# Altium project USB_Oscilloscope.PrjPcb (part 2 of 2)

## Sheet Trigger.SchDoc
size A; SheetNumber: 5; SheetTotal: 6
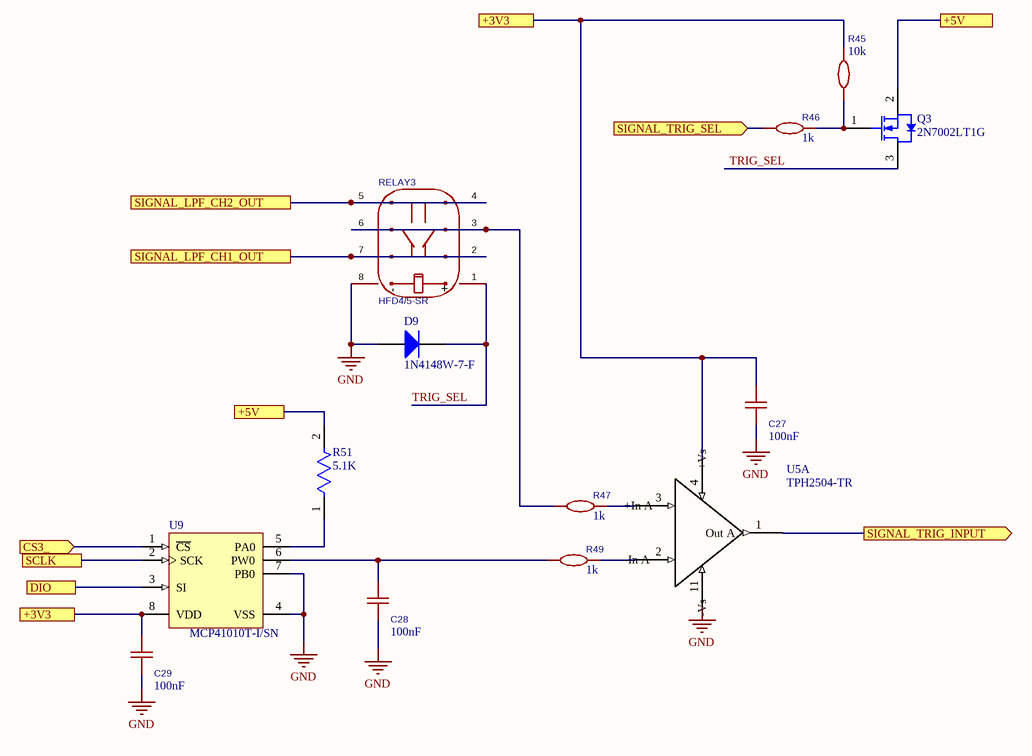
[diagram p4: Trigger.SchDoc]

### Parts
C27  value 100nF  [C0805]  (hidden comment: 0805CG6R0C500NT_C67560)
C28  value 100nF  [C0805]  (hidden comment: 0805CG6R0C500NT_C67560)
C29  value 100nF  [C0805]  (hidden comment: 0805CG6R0C500NT_C67560)
D9  1N4148W-7-F  [DIOD-SOD123-2_V]
Q3  2N7002LT1G  [ONSC-SOT-23-3-318-08_V]
R45  value 10k  [R0805]  (hidden comment: 0805W8F0000T5E_C17477)
R46  value 1k  [R0805]  (hidden comment: 0805W8F0000T5E_C17477)
R47  value 1k  [R0805]  (hidden comment: 0805W8F0000T5E_C17477)
R49  value 1k  [R0805]  (hidden comment: 0805W8F0000T5E_C17477)
R51  5.1K  [FP-RT0805-MFG]
RELAY3  HFD4/5-SR  [RELAY-SMD_HFD4-5-SR]
U5  TPH2504-TR  [TSOP65P640X120-14N]  (part A of 4)
U9  MCP41010T-I/SN  [SOIC-SN8_M]

### Ports
+3V3 (see H723ZG_Interface[1A], PGA[2A], PGA[2B], PGA[4A], PGA[4C], REF_VOLTAGE_RELAY_DRIVER[1A], REF_VOLTAGE_RELAY_DRIVER[2B], REF_VOLTAGE_RELAY_DRIVER[2C], REF_VOLTAGE_RELAY_DRIVER[4A], Trigger[1C]), +3V3 (see H723ZG_Interface[1A], PGA[2A], PGA[2B], PGA[4A], PGA[4C], REF_VOLTAGE_RELAY_DRIVER[1A], REF_VOLTAGE_RELAY_DRIVER[2B], REF_VOLTAGE_RELAY_DRIVER[2C], REF_VOLTAGE_RELAY_DRIVER[4A], Trigger[3A]), +5V (see H723ZG_Interface[1A], PGA[3A], PGA[3C], REF_VOLTAGE_RELAY_DRIVER[2C], REF_VOLTAGE_RELAY_DRIVER[3B], Trigger[2B]), +5V (see H723ZG_Interface[1A], PGA[3A], PGA[3C], REF_VOLTAGE_RELAY_DRIVER[2C], REF_VOLTAGE_RELAY_DRIVER[3B], Trigger[4A]), CS3_ (in, see H723ZG_Interface[3A]), DIO (see H723ZG_Interface[3A], PGA[4B], PGA[4C]), SCLK (see H723ZG_Interface[3A], PGA[4B], PGA[4C]), SIGNAL_LPF_CH1_OUT (see H723ZG_Interface[1C], LPF[4A]), SIGNAL_LPF_CH2_OUT (see H723ZG_Interface[1C], LPF[4C]), SIGNAL_TRIG_INPUT (out, see H723ZG_Interface[4C]), SIGNAL_TRIG_SEL (in, see H723ZG_Interface[4B])

### Nets
GND: C27.2 C28.2 C29.2 D9.1(A) RELAY3.8 U5.11(-Vs) U9.4(VSS) U9.7(PB0)
+3V3: C27.1 C29.1 R45.2 U5.4(+Vs) U9.8(VDD) ; port +3V3
+5V: Q3.2(S) R51.2 ; port +5V
CS3_: U9.1(~{CS}) ; port CS3_
DIO: U9.3(SI) ; port DIO
SCLK: U9.2(SCK) ; port SCLK
SIGNAL_LPF_CH1_OUT: RELAY3.2 RELAY3.7 ; port SIGNAL_LPF_CH1_OUT
SIGNAL_LPF_CH2_OUT: RELAY3.4 RELAY3.5 ; port SIGNAL_LPF_CH2_OUT
SIGNAL_TRIG_INPUT: U5.1(Out_A) ; port SIGNAL_TRIG_INPUT
SIGNAL_TRIG_SEL: R46.1 ; port SIGNAL_TRIG_SEL
TRIG_SEL: D9.2(K) Q3.3(D) RELAY3.1
NetC28_1: C28.1 R49.1 U9.6(PW0)
NetQ3_1: Q3.1(G) R45.1 R46.2
NetR47_1: R47.1 RELAY3.3 RELAY3.6
NetR47_2: R47.2 U5.3(+In_A)
NetR49_2: R49.2 U5.2(-In_A)
NetR51_1: R51.1 U9.5(PA0)

### Notes on the sheet
- (in symbol CMP-006-000000-2) -; +

### Library data of the parts
C27-C29 = CMP-015-000003-2: Capacitance:100nF Tolerance:±5% Tolerance:±5% Voltage Rating:50V Temperature Coefficient:X7R; Manufacturer: YAGEO(国巨); AddInBom: yes; Device: CC0805JRX7R9BB104; ModelId: 8c88e81f49c6409b980720ec8953afb6聨0819f05c4eef4c71ace90d822a990e87; ModelName: C0805_L2.0-W1.3-H1.3; ModelTransform: 78.74,51.181,0,0,0,0,0,0.0005,0; Temperature Coefficient: X7R; Tolerance: 5%; Voltage Rating: 50V; ConvertToPcb: yes; Datasheet: https://item.szlcsc.com/datasheet/CC0805JRX7R9BB104/112720.html; Design Item ID: CC0805JRX7R9BB104; FootprintName: C0805; JLCPCB Part Class: Extended Part; LCSC Part Name: 100nF ±5% 50V; Source: P1.SCHLIB; Supplier Footprint: 0805; Symbol: CC0805JRX7R9BB104; Manufacturer Part Number: CC0805JRX7R9BB104; Supplier Part Number: C111492
D9 = CMP-2000-04932-2: Fast Switching Diode, 100 V, 0.15 A, -65 to 150 degC, 2-Pin?SOD123, RoHS, Tape and Reel; Manufacturer: Diodes Inc; Recovery Time: 4ns; Unit Weight: 0.000353oz; Max Surge Current: 2A; Peak Reverse Voltage: 100V; Ir - Reverse Current: 1uA; Vf - Forward Voltage: 1.25V; Configuration: Single; If - Forward Current: 0.15A; Product Category: Diodes-GeneralPurpose,Power,Switching; Operating Temperature Range: -65Cto+150C; Packaging: Reel; Manufacturer URL: http://www.diodes.com/; Maximum Operating Temperature: +150C; Height: 1.25mm; Minimum Operating Temperature: -65C; Product: SwitchingDiodes; Package URL: http://www.diodes.com/datasheets/ds18004.pdf; Type: SwitchingDiode; Package Reference: SOD123-2; Width: 1.7mm; Datasheet URL: http://www.farnell.com/datasheets/1915529.pdf; Datasheet Version: Rev. 24-2, 10/2013; Series: 1N4148; Factory Pack Quantity: 3000; Length: 2.85mm; RoHS: True; Mounting Style: SMD/SMT; Package / Case: SOD-123
Q3 = CMP-1058-00781-1: Small Signal MOSFET, 60 V, 115 mA, N-Channel, 3-Pin SOT-23, Pb-Free, Tape and Reel; Manufacturer: On Semiconductor; Channel Polarity: N Channel; V(BR)DSS Min (V): 60; ID Max (A): 0.115; VGS Max (V): 20; Configuration: Single; VGS(th) Max (V): 2.5; ComponentLink1URL: http://www.onsemi.com/; ComponentLink3Description: Package Specification; ComponentLink3URL: http://www.onsemi.cn/pub_link/Collateral/318-08.PDF; PackageReference: SOT-23-3-318-08; RoHS: Pb-Free; ComponentLink2URL: http://www.onsemi.com/pub_link/Collateral/2N7002L-D.PDF; ComponentLink1Description: Manufacturer URL; Package Type: SOT-23-3; Packing: Tape and Reel; PartNumber: 2N7002LT1G; DatasheetVersion: Rev. 7; Mounting Technology: Surface Mount; ComponentLink2Description: Datasheet; PackageDescription: 3-Pin Small Outline Transistor, Body 2.92 x 1.3 mm, Pitch 0.95 mm; PackageVersion: Rev. AP, 11/2009
R45 = CMP-016-000002-1: Type:Thick Film Resistor Resistance:10kΩ Tolerance:±1% Tolerance:±1% Power(Watts):125mW Voltage-Supply(Max):150V Temperature Coefficient:±100ppm/℃ Temperature Coefficient:±100ppm/℃ Operating Temperature:-55℃~+155℃ Operating Temperature:-55℃~+155℃; Manufacturer: UNI-ROYAL(厚声); AddInBom: yes; Device: 0805W8F1002T5E; ModelId: b83c7c5430874b8eb2319a65d9433429聨0819f05c4eef4c71ace90d822a990e87; ModelName: R0805_L2.0-W1.3-H0.6; ModelTransform: 78.74,51.181,0,0,0,0,0,-0.0005,0; Power(Watts): 125mW; Tolerance: 1%; Voltage-Supply(Max): 150V; ConvertToPcb: yes; Datasheet: https://item.szlcsc.com/datasheet/0805W8F1002T5E/18102.html; Design Item ID: 0805W8F1002T5E; FootprintName: R0805; JLCPCB Part Class: Basic Part; LCSC Part Name: 10kΩ ±1% 125mW 厚膜电阻; Operating Temperature: -55℃~+155℃; Source: P1.SCHLIB; Supplier Footprint: 0805; Symbol: 0805W8F1002T5E; Temperature Coefficient: ±100ppm/℃; Type: Thick Film Resistor; Manufacturer Part Number: 0805W8F1002T5E; Supplier Part Number: C17414
R46 R47 R49 = CMP-016-000001-1: Type:Thick Film Resistors Resistance:1kΩ Tolerance:±1% Tolerance:±1% Power(Watts): Overload Voltage (Max): Temperature Coefficient:±100ppm/℃ Temperature Coefficient:±100ppm/℃ Operating Temperature Range:-55℃~+155℃ Operating Temperature Range:-55℃~+155℃; Manufacturer: UNI-ROYAL(厚声); AddInBom: yes; Device: 0805W8F1001T5E; ModelId: b83c7c5430874b8eb2319a65d9433429聨0819f05c4eef4c71ace90d822a990e87; ModelName: R0805_L2.0-W1.3-H0.6; ModelTransform: 78.74,51.181,0,0,0,0,0,-0.0005,0; Tolerance: 1%; ConvertToPcb: yes; Datasheet: https://atta.szlcsc.com/upload/public/pdf/source/20200306/C422600_1E6D84923E4A46A82E41ADD87F860B5C.pdf; Design Item ID: 0805W8F1001T5E; FootprintName: R0805; JLCPCB Part Class: Basic Part; LCSC Part Name: 1kΩ ±1% 125mW 厚膜电阻; Operating Temperature Range: -55℃~+155℃; Source: P1.SCHLIB; Supplier Footprint: 0805; Symbol: 0805W8F1001T5E; Temperature Coefficient: ±100ppm/℃; Type: Thick Film Resistors; Manufacturer Part Number: 0805W8F1001T5E; Supplier Part Number: C17513
R51 = CMP-00006-1: 125mW Thin Film Resistor ±50ppm/℃ ±1% 5.1kΩ 0805 Chip Resistor - Surface Mount ROHS; Manufacturer Package Identifier: 0805 (2012 metric); Voltage Rating: 150V; Temperature Coefficient: 50ppm/°C; Depth: 1.25mm; Max Power Dissipation: 125mW; Lifecycle Status: Production; Min Operating Temperature: -55°C; Mounting Technology: Surface Mount; Value: 5.1kΩ; Case Code (Imperial): 0805; Max Operating Temperature: 155°C; Radiation Hardening: No; Power Rating: 125mW; Number of Terminals: 2; Voltage Rating (DC): 150V; Case/Package: 0805; Length: 2mm; RoHS: Compliant; Number of Terminations: 2; China RoHS: Non-Compliant; Working Voltage: 150V; Termination: SMD/SMT; Military Standard: Not; Composition: Thin Film; Height: 500µm; Tolerance: 1%; REACH SVHC: Yes; Contact Plating: Tin; Width: 1.25mm; Lead Free: Lead Free
RELAY3 = CMP-006-000000-2: Coil Voltage:5V Contact Form:2 Form C: 2C (DPDT-CO) Number of Pins:8 Contact Rating:1A@30VDC；300mA@125VAC Switching Voltage(Max):250V@AC；220V@DC Contact Material:AgNi + Gold plated Coil Rated Power:140mW Coil Resistance:178Ω Switching Current(Max):2A Oper; Manufacturer: HF(宏发); Release Time: 3ms; Coil Voltage: 5V; Coil Type: Polarized-Single Coil; AddInBom: yes; ModelName: RELAY-SMD_L10.0-W6.5-H5.7-LS7.5-P2.2; ModelTransform: 393.7,307.086,0,0,0,0,-0.005,0,0; ModelId: abc4320b17a04819849f22b1ebcd3fe7聨0819f05c4eef4c71ace90d822a990e87; Switching Current(Max): 2A; Coil Resistance: 178Ω; Coil Rated Power: 140mW; Contact Resistance: 100mΩ; Contact Rating: 1A@30VDC；300mA@125VAC; Symbol: HFD4/5-S; JLCPCB Part Class: Extended Part; Operating Temperature: -40℃~+85℃; ConvertToPcb: yes; FootprintName: RELAY-SMD_HFD4-5-SR; Supplier Footprint: SMD,10x6.5mm; Device: HFD4/5-SR; Switching Voltage(Max): 250V@AC；220V@DC; Contact Form: 2 Form C: 2C (DPDT-CO); Datasheet: https://item.szlcsc.com/datasheet/HFD4%252F5-SR/65466.html; Contact Material: AgNi + Gold plated; Design Item ID: HFD4/5-SR; Number of Pins: 8; LCSC Part Name: 超小型5V继电器 双刀双掷; Source: P1.SCHLIB; Operate Time: 3ms; Manufacturer Part Number: HFD4/5-SR; Supplier Part Number: C64399
U5 = CMP-00002-9: Operational Amplifier, 4 Func, 5000uV Offset-Max, CMOS, PDSO14; Max Supply Voltage: 7V; Number of Circuits: 4; Nominal Supply Voltage (DC): 3V; Input Offset Voltage (Vos): 5mV; Max Supply Current: 48mA; GAIN: 120Meg; Unity Gain Bandwidth Product: 120MHz; Common Mode Rejection Ratio: 45dB; Slew Rate: 160V/µs; Number of Terminals: 14; Terminal Pitch: 650µm; Max Operating Temperature: 125°C; Height - Seated (Max): 1.2mm; Length: 4.96mm; Min Operating Temperature: -40°C; RoHS: Compliant; Width: 4.4mm; Case/Package: TSSOP; Temperature Grade: Automotive
U9 = CMP-0188-00466-2: Single/Dual Digital Potentiometer with SPI Interface, 8-Pin SOIC 150mil, Industrial Temperature, Tape and Reel; ComponentLink2URL: http://ww1.microchip.com/downloads/en/DeviceDoc/11195c.pdf; PackageReference: SOIC-SN8; PackageDescription: 8-Lead Plastic Small Outline (SN) - Narrow, 3.90mm Body [SOIC]; ComponentLink3URL: http://www.microchip.com/stellent/groups/techpub_sg/documents/packagingspec/en012702.pdf; ComponentLink2Description: Datasheet; Code_JEDEC: MS-012; ComponentLink1URL: http://www.microchip.com/; PackageVersion: revBB, Aug-2009; DatasheetVersion: Jul-2003; ComponentLink1Description: Manufacturer URL; ComponentLink3Description: Package Specification; Code_IPC: SOIC127P600-8; RevisionNote: URLs added.

## Sheet H723ZG_Interface.SchDoc
size A; SheetNumber: 6; SheetTotal: 6
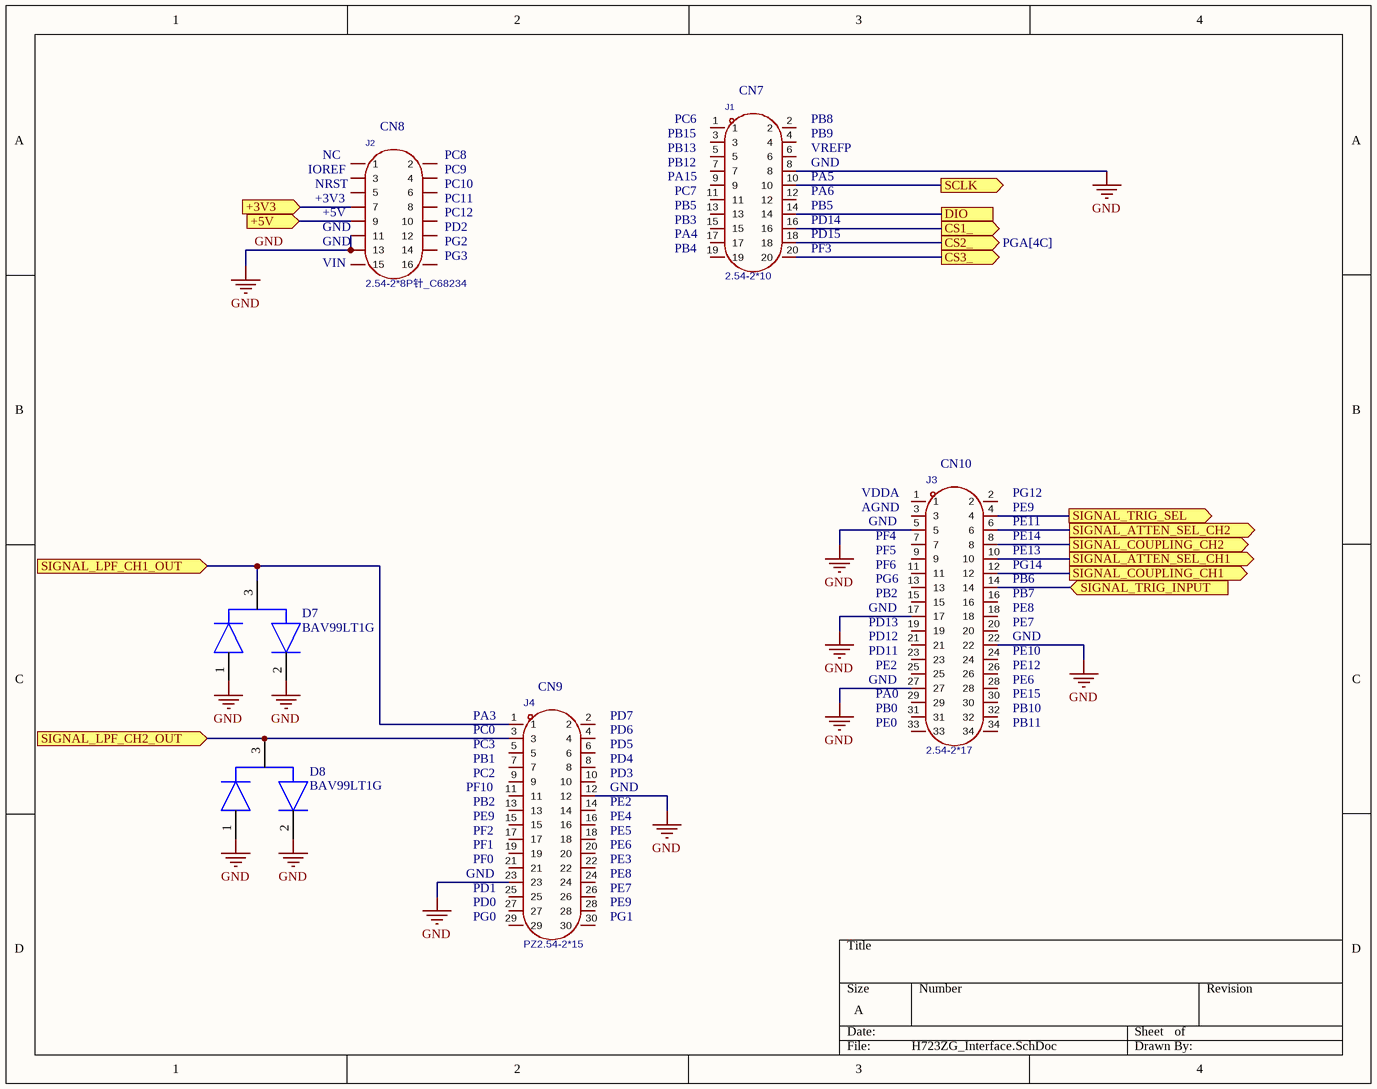
[diagram p5: H723ZG_Interface.SchDoc]

### Parts
D7  BAV99LT1G  [FP-318-08-IPC_B]
D8  BAV99LT1G  [FP-318-08-IPC_B]
J1  2.54-2*10  [HDR-TH_20P-P2.54-V-M-R2-C10-S2.54]
J2  2.54-2*8P针_C68234  [HDR-TH_16P-P2.54-V-M-R2-C8-S2.54]
J3  2.54-2*17  [HDR-TH_34P-P2.54-V-M-R2-C17-S2.54-2]
J4  PZ2.54-2*15  [HDR-TH_30P-P2.54-V-M-R2-C15-S2.54-2]

### Ports
+3V3 (in, see PGA[2A], PGA[2B], PGA[4A], PGA[4C], REF_VOLTAGE_RELAY_DRIVER[1A], REF_VOLTAGE_RELAY_DRIVER[2B], REF_VOLTAGE_RELAY_DRIVER[2C], REF_VOLTAGE_RELAY_DRIVER[4A], Trigger[1C], Trigger[3A]), +5V (in, see PGA[3A], PGA[3C], REF_VOLTAGE_RELAY_DRIVER[2C], REF_VOLTAGE_RELAY_DRIVER[3B], Trigger[2B], Trigger[4A]), CS1_ (out, see PGA[4A]), CS2_ (out, see PGA[4C]), CS3_ (out, see Trigger[1C]), DIO (see PGA[4B], PGA[4C], Trigger[1C]), SCLK (out, see PGA[4B], PGA[4C], Trigger[1C]), SIGNAL_ATTEN_SEL_CH1 (out, see REF_VOLTAGE_RELAY_DRIVER[1B]), SIGNAL_ATTEN_SEL_CH2 (out, see REF_VOLTAGE_RELAY_DRIVER[1C]), SIGNAL_COUPLING_CH1 (out, see analog_input[1B]), SIGNAL_COUPLING_CH2 (out, see analog_input[1D]), SIGNAL_LPF_CH1_OUT (in, see LPF[4A], Trigger[2B]), SIGNAL_LPF_CH2_OUT (in, see LPF[4C], Trigger[2A]), SIGNAL_TRIG_INPUT (in, see Trigger[4C]), SIGNAL_TRIG_SEL (out, see Trigger[3A])

### Nets
GND: D7.1(A) D7.2(C) D8.1(A) D8.2(C) J1.8 J2.11 J2.13 J3.5 J3.17 J3.22 J3.27 J4.12 J4.23
+3V3: J2.7 ; port +3V3
+5V: J2.9 ; port +5V
CS1_: J1.16 ; port CS1_
CS2_: J1.18 ; port CS2_
CS3_: J1.20 ; port CS3_
DIO: J1.14 ; port DIO
SCLK: J1.10 ; port SCLK
SIGNAL_ATTEN_SEL_CH1: J3.10 ; port SIGNAL_ATTEN_SEL_CH1
SIGNAL_ATTEN_SEL_CH2: J3.6 ; port SIGNAL_ATTEN_SEL_CH2
SIGNAL_COUPLING_CH1: J3.12 ; port SIGNAL_COUPLING_CH1
SIGNAL_COUPLING_CH2: J3.8 ; port SIGNAL_COUPLING_CH2
SIGNAL_LPF_CH1_OUT: D7.3(CATHODE/ANODE) J4.1 ; port SIGNAL_LPF_CH1_OUT
SIGNAL_LPF_CH2_OUT: D8.3(CATHODE/ANODE) J4.3 ; port SIGNAL_LPF_CH2_OUT
SIGNAL_TRIG_INPUT: J3.14 ; port SIGNAL_TRIG_INPUT
SIGNAL_TRIG_SEL: J3.4 ; port SIGNAL_TRIG_SEL

Not connected (* = marked no-connect by the designer): J1 1 2 3 4 5 6 7 9 11 12 13 15 17 19; J2 1 2 3 4 5 6 8 10 12 14 15 16; J3 1 2 3 7 9 11 13 15 16 18 19 20 21 23 24 25 26 28 29 30 31 32 33 34; J4 2 4 5 6 7 8 9 10 11 13 14 15 16 17 18 19 20 21 22 24 25 26 27 28 29 30

### Notes on the sheet
- (near J1) CN7
- (near J2) IOREF
- (near J2) NC
- (near J2) CN8
- (near J2) PC8
- (near J2) PC9
- (near J1) PB12
- (near J1) PB15
- (near J1) PB13
- (near J1) PC6
- (near J1) PB8
- (near J1) PB9
- (near J1) VREFP
- (near J1) GND
- (near J2) NRST
- (near J2) +3V3
- (near J2) +5V
- (near J2) GND
- (near J2) PC10
- (near J2) PC12
- (near J2) PD2
- (near J2) PG2
- (near J2) PC11
- (near J1) PA15
- (near J1) PB4
- (near J1) PA4
- (near J1) PB3
- (near J1) PB5
- (near J1) PC7
- (near J1) PD14
- (near J1) PA5
- (near J1) PA6
- (near J1) PD15
- (near J1) PF3
- (near J2) VIN
- (near J2) PG3
- (near J3) VDDA
- (near J3) AGND
- (near J3) GND
- (near J3) PF4
- (near J3) CN10
- (near J3) PE9
- (near J3) PE11
- (near J3) PE14
- (near J3) PG12
- (near J3) PF5
- (near J3) PF6
- (near J3) PG6
- (near J3) PB2
- (near J3) PE13
- (near J3) PB6
- (near J3) PB7
- (near J3) PG14
- (near J3) PD11
- (near J3) PD12
- (near J3) PD13
- (near J3) PE2
- (near J3) PE6
- (near J3) PE7
- (near J3) PE8
- (near J3) PE10
- (near J3) PE12
- (near J4) PA3
- (near J4) PC0
- (near J4) PC3
- (near J4) CN9
- (near J4) PD5
- (near J4) PD6
- (near J4) PD7
- (near J3) PA0
- (near J3) PB0
- (near J3) PE0
- (near J3) PE15
- (near J3) PB10
- (near J3) PB11
- (near J4) PF10
- (near J4) PE9
- (near J4) PB2
- (near J4) PC2
- (near J4) PB1
- (near J4) PD3
- (near J4) PD4
- (near J4) GND
- (near J4) PE2
- (near J4) PE4
- (near J4) PD1
- (near J4) PF0
- (near J4) PF1
- (near J4) PF2
- (near J4) PE3
- (near J4) PE5
- (near J4) PE6
- (near J4) PE7
- (near J4) PE8
- (near J4) PG0
- (near J4) PD0
- (near J4) PG1

### Library data of the parts
D7 D8 = CMP-07163-000036-1: DIODE ARRAY 100V 215MA SOT23-3; Capacitance: 1.5pF; Current Rating: 200mA; Max Repetitive Reverse Voltage (Vrrm): 70V; Forward Voltage: 1.25V; Max Forward Surge Current (Ifsm): 500mA; Peak Reverse Current: 2.5uA; Forward Current: 150mA; Peak Non-Repetitive Surge Current: 2A; Reverse Recovery Time: 6ns; Length: 2.9mm; Voltage Rating (DC): 70V; Case/Package: SOT-23; Height: 0.94mm; Number of Pins: 3; Mount: Surface Mount; Min Operating Temperature: -65°C; Lead Free: Lead Free; REACH SVHC: No SVHC; Width: 1.3mm; Packaging: Tape and Reel; Max Operating Temperature: 150°C
J1 = CMP-012-000002-1: Pin Structure:2x10P Pitch:2.54mm Row Spacing:2.54mm Circluar Pins/Square Pins:Pin Header Mounting Type:Through Hole Number of Rows:2 Number of Pins:20P Current Rating:2.5A Length of Mating Pin:6mm Insulation Height:2.54mm Length of End Connection Pin:3mm; Manufacturer: ZHOURI(洲日); Pin Structure: 2x10P; ConvertToPcb: yes; ModelName: HDR-TH_20P-P2.54-V-M-R2-C10-S2.54-1; Row Spacing: 2.54mm; Current Rating: 2.5A; ModelTransform: 1000.3917,199.9996,0,0,0,0,0,0,-118.11; ModelId: 7b46918fe38e4962af531f5fab9490b0聨0819f05c4eef4c71ace90d822a990e87; LCSC Part Name: 2x10P 间距:2.54mm 方针 直插; Insulation Height: 2.54mm; Length of End Connection Pin: 3mm; FootprintName: HDR-TH_20P-P2.54-V-M-R2-C10-S2.54; AddInBom: yes; Contact Plating: Gold; Device: 2.54-2*10; Supplier Footprint: 插件,P=2.54mm; Length of Mating Pin: 6mm; Mounting Type: Through Hole; Contact Material: Brass; Symbol: 2.54-2*10; Number of Pins: 20P; Circluar Pins/Square Pins: Pin Header; JLCPCB Part Class: Extended Part; Operating Temperature: -40℃~+105℃; Source: P1.SCHLIB; Number of Rows: 2; Datasheet: https://item.szlcsc.com/datasheet/2.54-2*10/5692723.html; Pitch: 2.54mm; Design Item ID: 2.54-2*10; Manufacturer Part Number: 2.54-2*10; Supplier Part Number: C5116480
J2 = CMP-012-000001-1: Pin Structure:2x8P Pitch:2.54mm Row Spacing:2.54mm Circluar Pins/Square Pins:Pin Header Mounting Type:Through Hole Number of Rows:2 Number of Pins:16P Current Rating:3A Voltage Rating (Max):- Length of Mating Pin:5.9mm Insulation Height:2.54mm Length of E; Manufacturer: BOOMELE(博穆精密); Current Rating: 3A; ModelTransform: 799.99844,200,0,0,0,0,0,0,-118.11; Pitch: 2.54mm; ModelName: HDR2.54-M-LI-2X8P; Symbol: Header-Male-2.54_2x8; ModelId: e9bbe0154d6648aeb599214ae56f6999聨0819f05c4eef4c71ace90d822a990e87; Pin Structure: 2x8P; AddInBom: yes; Number of Pins: 16P; Operating Temperature: -55℃~+105℃; Contact Material: Brass; Color: Black; Length of End Connection Pin: 3mm; Length of Mating Pin: 5.9mm; Supplier Footprint: 插件,P=2.54mm; Insulation Height: 2.54mm; Design Item ID: 2.54-2*8P针_C68234; Mounting Type: Through Hole; Voltage Rating (Max): -; Number of Rows: 2; FootprintName: HDR-TH_16P-P2.54-V-M-R2-C8-S2.54; Contact Plating: Gold; Device: 2.54-2*8P针_C68234; Datasheet: https://item.szlcsc.com/datasheet/2.54-2*8P%25E9%2592%2588/69336.html; JLCPCB Part Class: Extended Part; Row Spacing: 2.54mm; Circluar Pins/Square Pins: Pin Header; Source: P1.SCHLIB; ConvertToPcb: yes; LCSC Part Name: 2x8P 间距:2.54mm 方针 直插; Manufacturer Part Number: 2.54-2*8P针; Supplier Part Number: C68234
J3 = CMP-012-000006-1: 2.54mm pitch, 2 rows, 2*17, 34 pins total
J4 = CMP-012-000005-1: Pin Structure:2x15P Pitch:2.54mm Row Spacing:2.54mm Circluar Pins/Square Pins:Pin Header Mounting Type:Through Hole Number of Rows:2 Number of Pins:30P Current Rating:2.5A Length of Mating Pin:6mm Insulation Height:2.54mm Length of End Connection Pin:3mm; Manufacturer: ZHOURI(洲日); AddInBom: yes; Pin Structure: 2x15P; Row Spacing: 2.54mm; ModelTransform: 1500.036,196.85,0,0,0,0,0,0,-118.11; ModelId: 20e3c55689c04fa0b6843741cd965711聨0819f05c4eef4c71ace90d822a990e87; Current Rating: 2.5A; Number of Rows: 2; Datasheet: https://item.szlcsc.com/datasheet/PZ2.54-2*15/5925192.html; FootprintName: HDR-TH_30P-P2.54-V-M-R2-C15-S2.54-2; ConvertToPcb: yes; Device: PZ2.54-2*15; Pitch: 2.54mm; Mounting Type: Through Hole; Length of End Connection Pin: 3mm; Length of Mating Pin: 6mm; LCSC Part Name: 2x15P 间距:2.54mm 方针 直插; Contact Material: Brass; Design Item ID: PZ2.54-2*15; JLCPCB Part Class: Extended Part; Insulation Height: 2.54mm; Operating Temperature: -40℃~+105℃; Source: P1.SCHLIB; Supplier Footprint: 插件,P=2.54mm; Contact Plating: Gold; Symbol: PZ2.54-2*15; ModelName: HDR-TH_30P-P2.54-V-M-R2-C15-S2.54-2; Number of Pins: 30P; Circluar Pins/Square Pins: Pin Header; Manufacturer Part Number: PZ2.54-2*15; Supplier Part Number: C5224013

## Nets that join several sheets
GND: Analog_Input (24 pins), PGA (12 pins), REF_VOLTAGE_RELAY_DRIVER (5 pins), LPF (8 pins), Trigger (8 pins), H723ZG_Interface (13 pins)
+1V625: PGA (R32.1 R50.1), REF_VOLTAGE_RELAY_DRIVER (R38.1 R39.1)
+3V3: PGA (6 pins), REF_VOLTAGE_RELAY_DRIVER (6 pins), Trigger (5 pins), H723ZG_Interface (J2.7)
+5V: PGA (C9.2 C21.2 U2.1 U6.1), REF_VOLTAGE_RELAY_DRIVER (Q1.2 Q2.2), Trigger (Q3.2 R51.2), H723ZG_Interface (J2.9)
ATTEN_SEL_CH1: Analog_Input (D3.2 RELAY2.1), REF_VOLTAGE_RELAY_DRIVER (Q1.3)
ATTEN_SEL_CH2: Analog_Input (D6.2 RELAY1.1), REF_VOLTAGE_RELAY_DRIVER (Q2.3)
CS1_: PGA (U2.9), H723ZG_Interface (J1.16)
CS2_: PGA (U6.9), H723ZG_Interface (J1.18)
CS3_: Trigger (U9.1), H723ZG_Interface (J1.20)
DIO: PGA (U2.8 U6.8), Trigger (U9.3), H723ZG_Interface (J1.14)
SCLK: PGA (U2.7 U6.7), Trigger (U9.2), H723ZG_Interface (J1.10)
SIGNAL_ATTEN_SEL_CH1: REF_VOLTAGE_RELAY_DRIVER (R42.1), H723ZG_Interface (J3.10)
SIGNAL_ATTEN_SEL_CH2: REF_VOLTAGE_RELAY_DRIVER (R44.1), H723ZG_Interface (J3.6)
SIGNAL_CH1_CLAMPED: Analog_Input (D2.2 R5.1), PGA (R30.2)
SIGNAL_CH2_CLAMPED: Analog_Input (D4.2 R8.1), PGA (R34.2)
SIGNAL_COUPLING_CH1: Analog_Input (R6.1), H723ZG_Interface (J3.12)
SIGNAL_COUPLING_CH2: Analog_Input (R20.1), H723ZG_Interface (J3.8)
SIGNAL_LPF_CH1_IN: PGA (U2.5), LPF (R12.1)
SIGNAL_LPF_CH1_OUT: LPF (C6.1 R26.2), Trigger (RELAY3.2 RELAY3.7), H723ZG_Interface (D7.3 J4.1)
SIGNAL_LPF_CH2_IN: PGA (U6.5), LPF (R21.2)
SIGNAL_LPF_CH2_OUT: LPF (C15.1 R27.1 U5.14), Trigger (RELAY3.4 RELAY3.5), H723ZG_Interface (D8.3 J4.3)
SIGNAL_TRIG_INPUT: Trigger (U5.1), H723ZG_Interface (J3.14)
SIGNAL_TRIG_SEL: Trigger (R46.1), H723ZG_Interface (J3.4)